# EAGLE board pc_healthypi_5.7 (EAGLE 9.6.2)
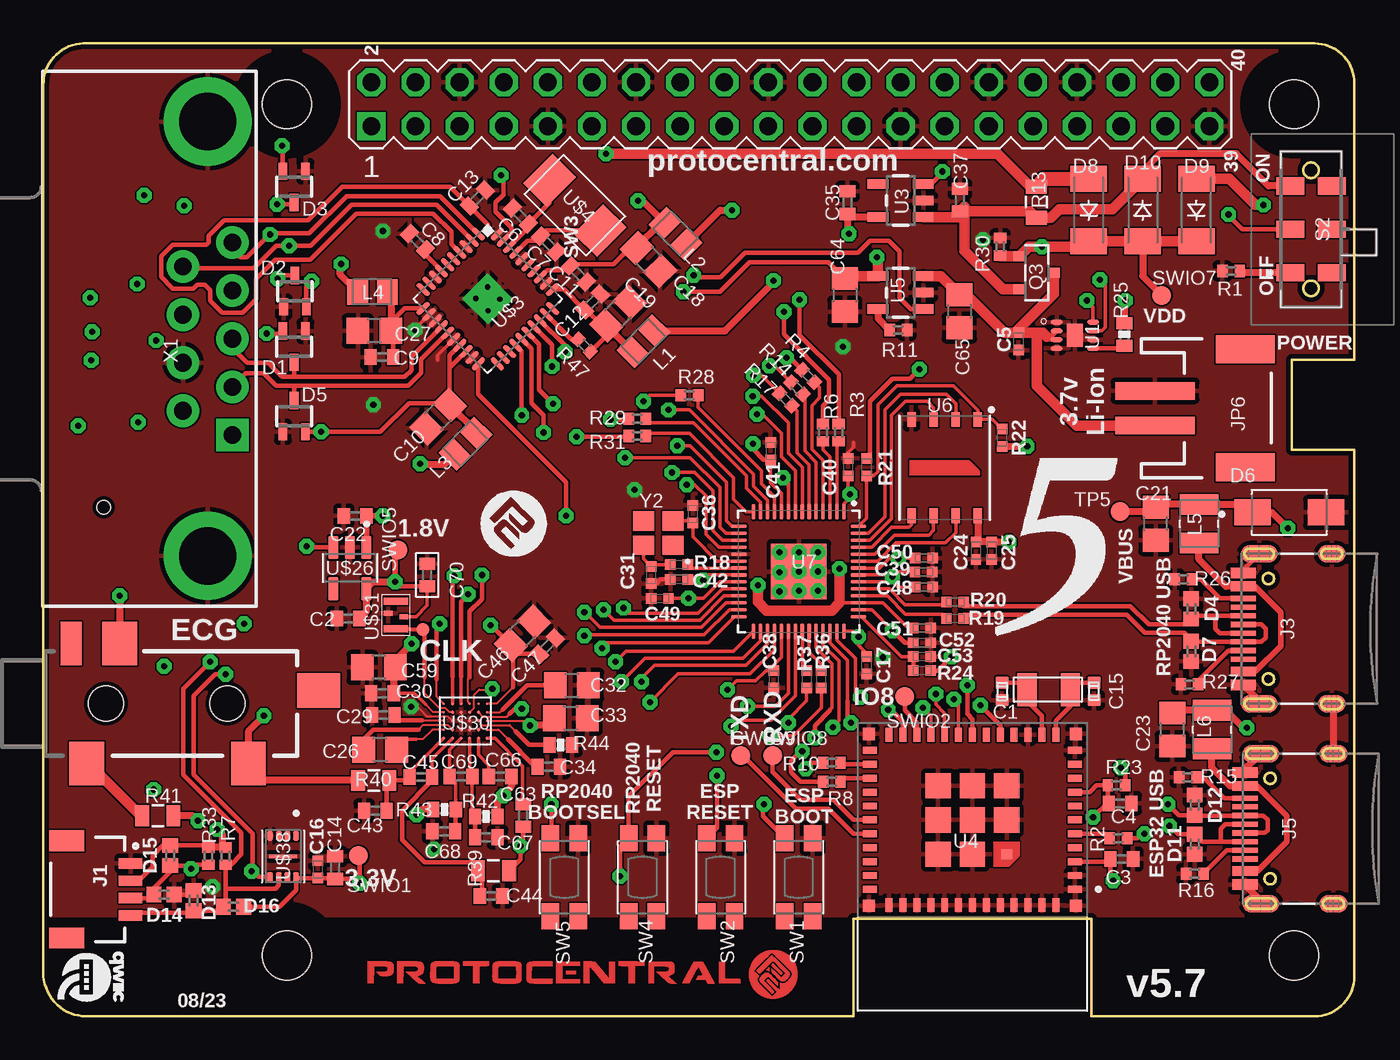
[diagram p3: board, top side]
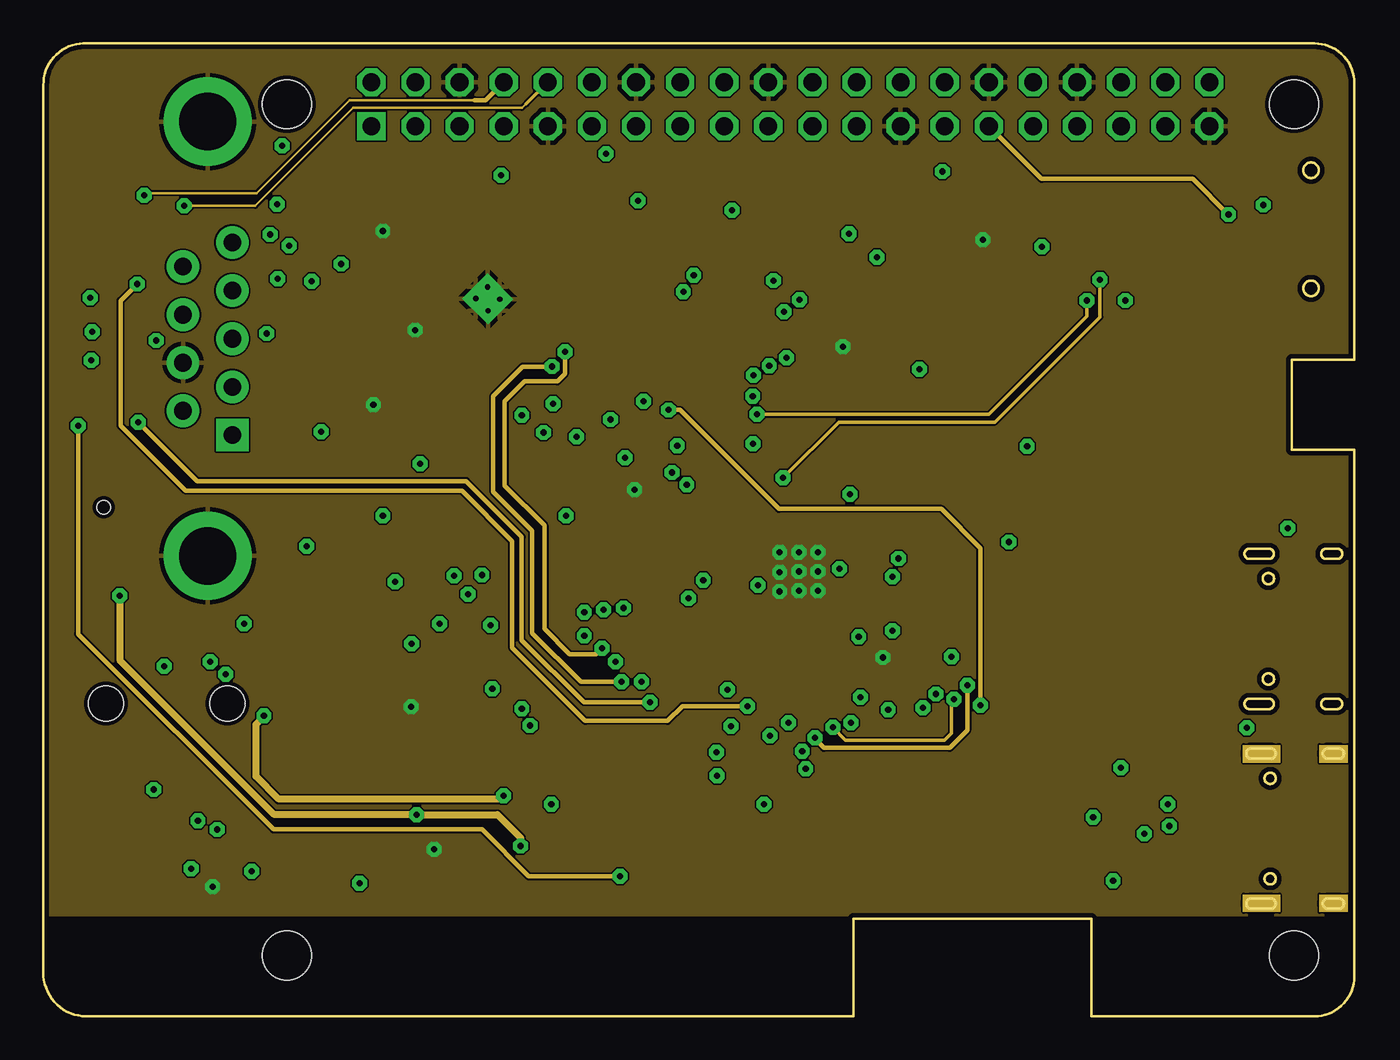
[diagram p4: board, inner layer Route2]
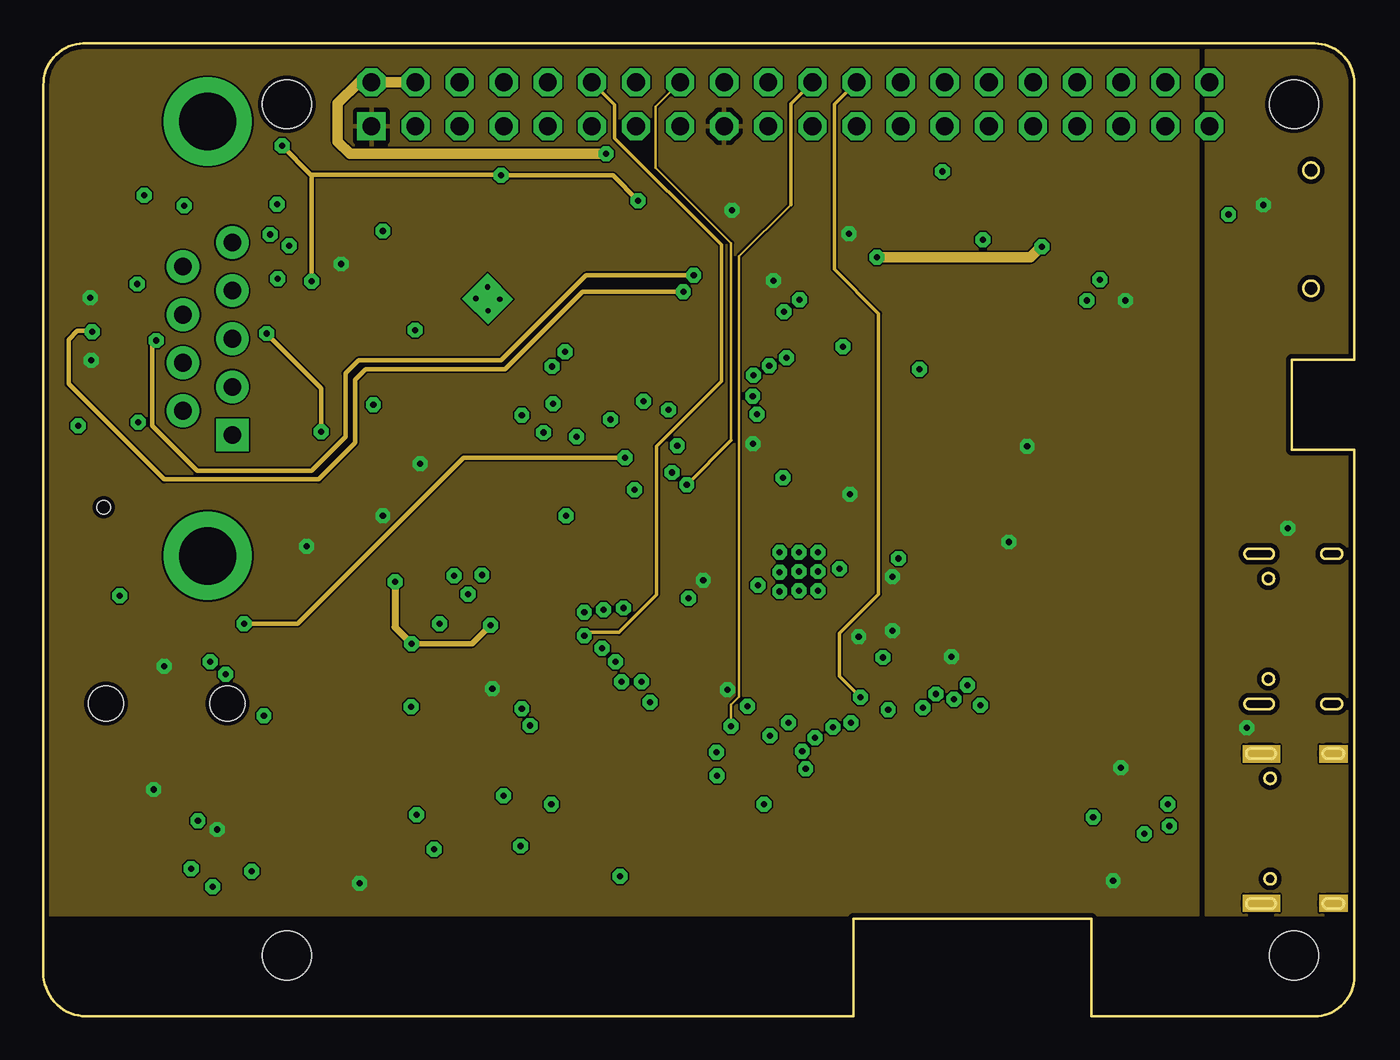
[diagram p5: board, inner layer Route15]
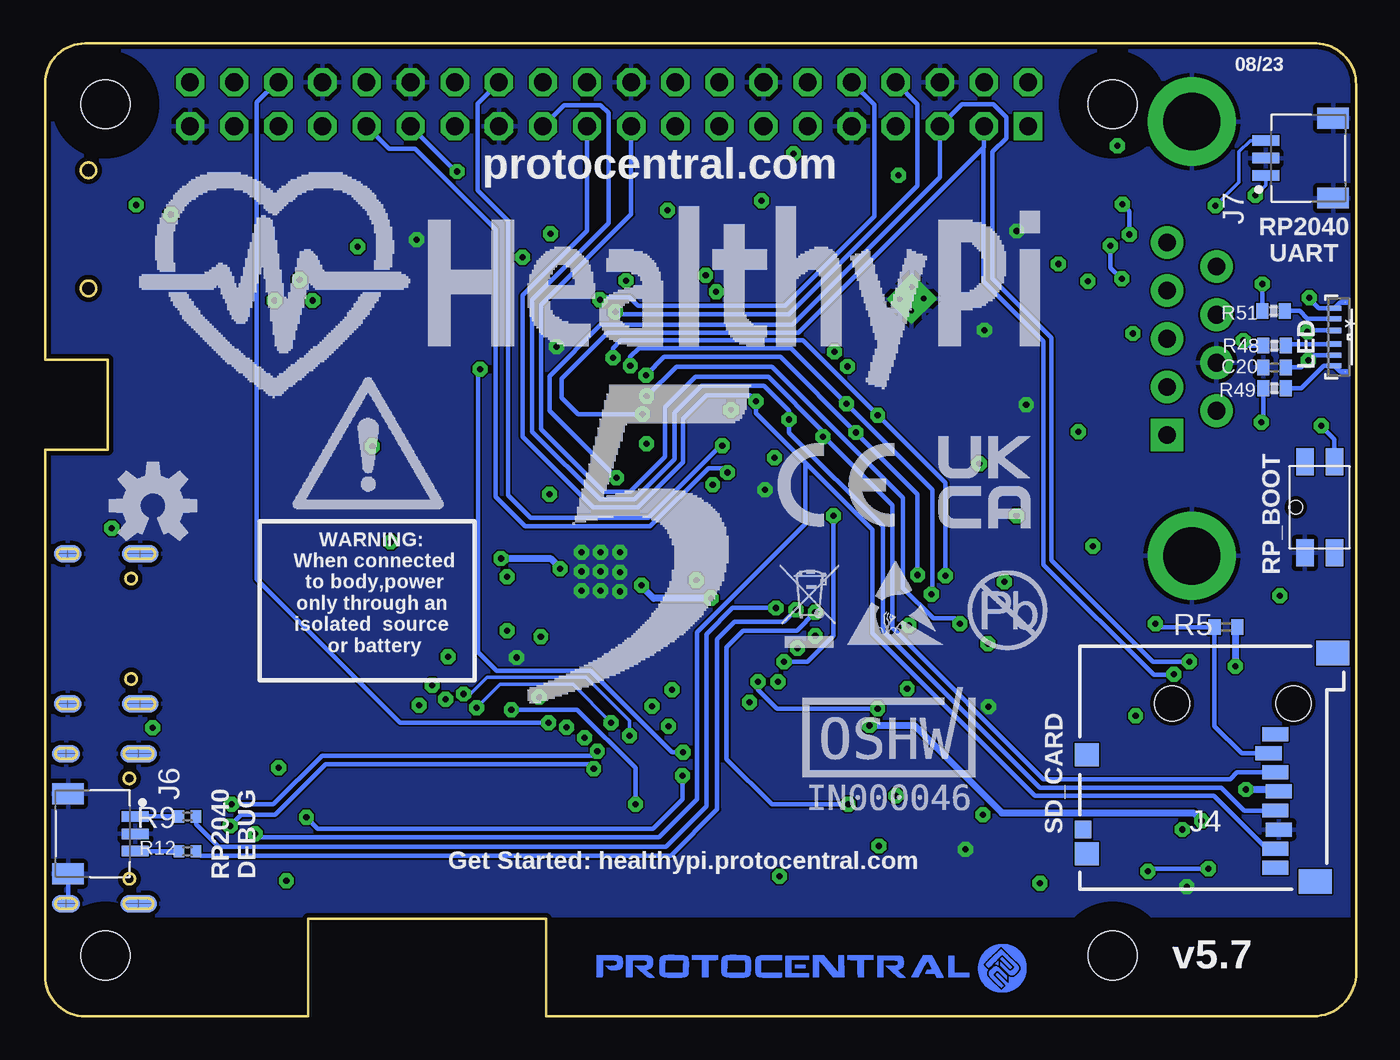
[diagram p6: board, bottom side, seen from below]

Size 75.5 x 56.01 mm. Coordinates in mm from the lower left corner, seen from the top.
Outline: 635 segments
Copper layers (1+2*15+16): Top 0.035mm / dielectric 1.5mm / Route2 0.035mm / dielectric 0.15mm / Route15 0.035mm / dielectric 0.2mm / Bottom 0.035mm
Design rules "Circuitects-Rules *": minimum track width 3mil, minimum drill 0.1mm, track to track 4mil, track to pad 4mil, pad to pad 4mil, via to via 6mil, smd to smd 6mil, copper to edge 10mil, drill to drill 4mil, minimum pad ring 12mil, minimum via ring 10mil, stop-mask expansion 4mil, vias tented up to drill 25mil, thermal gap 10mil
Net classes: 1 power: width 0.178 mm; 2 Clock: width 0.089 mm, clearance 0.178 mm; 4 USBpair: width 0.102 mm, drill 0.1 mm, clearance 0.15 mm to class 3; 5 IN pairs: width 0.152 mm, clearance 0.406 mm to class 0
Holes 2.8 mm at 72.02,3.51 72.02,52.51 14.02,52.51 14.02,3.51
Holes 0.9 mm at 73,48.71 73,41.91
Holes 0.65 mm at 70.64,7.92 70.64,13.7 70.55,19.42 70.55,25.2
tRestrict: area 12.5,51 to 15.6,54.1; area 70.5,51 to 73.6,54.1; area 70.5,2 to 73.6,5.1; area 12.5,2 to 15.6,5.1
bRestrict: area 12.5,2 to 15.6,5.1; area 12.5,51 to 15.6,54.1; area 70.5,2 to 73.6,5.1; area 70.5,51 to 73.6,54.1

## Footprints (pad centres in the part's own frame; a part is rotated, then mirrored left to right if it is on the bottom)
C0402 = smd 0.75 x 0.7: 1 0,0.5; 2 0,-0.5
C0402' = smd 0.7 x 0.9: 1 -0.65,0; 2 0.65,0
0402-TIGHT = smd 0.6 x 0.6: 1 -0.5,0; 2 0.5,0
C0805 = smd 1.3 x 1.5: 1 -0.95,0; 2 0.95,0
0402 = smd 0.7 x 0.9: 1 -0.65,0; 2 0.65,0
SOT323 = smd 0.5 x 1: 1 0,0.9; 2 -0.65,-0.9; 3 0.65,-0.9
0402' = smd 0.85 x 0.9: 1 -0.58,0; 2 0.58,0
DIOM4325X250N = smd 2.12 x 1.5: A 2.115,0; C -2.115,0
SOD-123_MINI-SMA = smd 1.5 x 2.1: A 1.8,0; C -1.8,0
JST04_1MM_RA = smd 0.6 x 1.35: 1 -1.5,0; 2 -0.5,0; 3 0.5,0; 4 1.5,0 | smd 1.2 x 2: NC1 2.8,-3.675; NC2 -2.8,-3.675
USB-C-16P = smd 0.3 x 1.45: A5 -1.25,0; A6 -0.25,0; A7 0.25,0; A8 1.25,0; B5 1.75,0; B6 0.75,0; B7 -0.75,0; B8 -1.75,0 | smd 0.6 x 1.45: GND -3.225,0; GND2 3.225,0 | smd 1 x 2.1: SHLD1 -4.32,-0.915; SHLD2 4.32,-0.915 | smd 1 x 2.1 bottom: SHLD3 -4.32,-0.915; SHLD4 4.32,-0.915 | smd 1 x 1.6: SHLD5 -4.32,-5.095; SHLD8 4.32,-5.095 | smd 1 x 1.6 bottom: SHLD6 -4.32,-5.095; SHLD7 4.32,-5.095 | smd 0.55 x 1.45: VBUS1 -2.45,0; VBUS2 2.45,0 | hole 0.65: -2.89,-1.445; 2.89,-1.445
GCT_MEM2051-00-195-00-A = smd 0.8 x 1.5: 1 1.94,-3.66; 2 0.84,-3.26; 3 -0.26,-3.66; 4 -1.36,-3.86; 5 -2.46,-3.66; 6 -3.56,-3.86; 7 -4.66,-3.66; 8 -5.76,-3.66 | smd 1 x 0.95: 9 -3.56,7.425 | smd 1.3 x 1.4: P1 -4.95,7.2; P2 0.75,7.2 | smd 1.4 x 1.9: P3 6.6,-6.95; P4 -6.55,-5.95
JST_SM03B-SRSS-TB(LF)(SN) = smd 0.6 x 1.55: 1 -1,0; 2 0,0; 3 1,0 | smd 1.2 x 1.8: S1 -2.3,-3.875; S2 2.3,-3.875
AUDIO-JACK-3.5MM-SMD = smd 2 x 2.5: RING 4.3,3.45; SLEEVE 2.4,-3.45; TIP 11.7,-3.45 | smd 1.2 x 2.5: RSH 1.5,3.45 | smd 2.5 x 2: TSH 15.75,0.75 | hole 2: 3.5,0; 10.5,0
JST-2-SMD = smd 1 x 4.6: 1 -1,-3.7; 2 1,-3.7 | smd 1.6 x 3.4: NC1 -3.4,1.5; NC2 3.4,1.5
PIN_20X2 = drill 1.016 square: 1 -24.13,-1.27 | drill 1.016 octagon: 2 -24.13,1.27; 3 -21.59,-1.27; 4 -21.59,1.27; 5 -19.05,-1.27; 6 -19.05,1.27; 7 -16.51,-1.27; 8 -16.51,1.27; 9 -13.97,-1.27; 10 -13.97,1.27; 11 -11.43,-1.27; 12 -11.43,1.27; 13 -8.89,-1.27; 14 -8.89,1.27; 15 -6.35,-1.27; 16 -6.35,1.27; 17 -3.81,-1.27; 18 -3.81,1.27; 19 -1.27,-1.27; 20 -1.27,1.27; 21 1.27,-1.27; 22 1.27,1.27; 23 3.81,-1.27; 24 3.81,1.27; 25 6.35,-1.27; 26 6.35,1.27; 27 8.89,-1.27; 28 8.89,1.27; 29 11.43,-1.27; 30 11.43,1.27; 31 13.97,-1.27; 32 13.97,1.27; 33 16.51,-1.27; 34 16.51,1.27; 35 19.05,-1.27; 36 19.05,1.27; 37 21.59,-1.27; 38 21.59,1.27; 39 24.13,-1.27; 40 24.13,1.27
INDC2012X105N = smd 1.2 x 1.47: 1 -0.86,0; 2 0.86,0
INDC2520X100N = smd 1.2 x 2.22: 1 -1.11,0; 2 1.11,0
LTST-008BGEW_LTO = smd 0.051 x 0.051: 1 2,0.372; 8 -2,0.372 | smd 0.305 x 0.813: 2 1.65,-0.268; 3 1.05,-0.268; 4 0.41,-0.268; 5 -0.38,-0.268; 6 -1.05,-0.268; 7 -1.65,-0.268
SOT23-R = smd 0.6 x 0.7: 1 -0.95,-1; 2 0.95,-1; 3 0,1
R0402 = smd 0.6 x 0.7: 1 -0.5,0; 2 0.5,0
R0402' = smd 0.7 x 0.9: 1 -0.65,0; 2 0.65,0
0805 = smd 0.8 x 1.2: 1 -0.9,0; 2 0.9,0
0402-RES = smd 0.7 x 0.9: 1 -0.65,0; 2 0.65,0
JS202011JAQN = smd 1 x 1.6: 1 -2.5,1.2; 2 0,1.2; 3 2.5,1.2; 4 -2.5,-1.2; 5 0,-1.2; 6 2.5,-1.2 | hole 0.9: -3.4,0; 3.4,0
BTN_KMR2_4.6X2.8 = smd 1.5 x 1: A 2.25,0.8; A' -2.25,0.8; B 2.25,-0.8; B' -2.25,-0.8
TP11R = smd 1.1 x 1.1: TP 0,0
PAD.03X.03 = smd 0.762 x 0.762: P$1 0,0
SON50P200X200X80-9N = smd 0.7 x 0.3: 1 -1.05,0.75; 2 -1.05,0.25; 3 -1.05,-0.25; 4 -1.05,-0.75; 5 1.05,-0.75; 6 1.05,-0.25; 7 1.05,0.25; 8 1.05,0.75 | smd 0.9 x 1.3: 9 0,0
SOT23-5 = smd 0.55 x 1.2: 1 -0.95,-1.3; 2 0,-1.3; 3 0.95,-1.3; 4 0.95,1.3; 5 -0.95,1.3
XCVR_ESP32-C3-MINI-1-N4 = smd 0.8 x 0.4: 1 -5.9,1.3; 2 -5.9,0.5; 3 -5.9,-0.3; 4 -5.9,-1.1; 5 -5.9,-1.9; 6 -5.9,-2.7; 7 -5.9,-3.5; 8 -5.9,-4.3; 9 -5.9,-5.1; 10 -5.9,-5.9; 11 -5.9,-6.7; 25 5.9,-6.7; 26 5.9,-5.9; 27 5.9,-5.1; 28 5.9,-4.3; 29 5.9,-3.5; 30 5.9,-2.7; 31 5.9,-1.9; 32 5.9,-1.1; 33 5.9,-0.3; 34 5.9,0.5; 35 5.9,1.3 | smd 0.4 x 0.8: 12 -4.8,-7.6; 13 -4,-7.6; 14 -3.2,-7.6; 15 -2.4,-7.6; 16 -1.6,-7.6; 17 -0.8,-7.6; 18 0,-7.6; 19 0.8,-7.6; 20 1.6,-7.6; 21 2.4,-7.6; 22 3.2,-7.6; 23 4,-7.6; 24 4.8,-7.6; 36 4.8,2.2; 37 4,2.2; 38 3.2,2.2; 39 2.4,2.2; 40 1.6,2.2; 41 0.8,2.2; 42 0,2.2; 43 -0.8,2.2; 44 -1.6,2.2; 45 -2.4,2.2; 46 -3.2,2.2; 47 -4,2.2; 48 -4.8,2.2 | smd 0.6 x 0.6: 49_1 -1.975,-0.725 | smd 1.45 x 1.45: 49_2 0,-0.725; 49_3 1.975,-0.725; 49_4 1.975,-2.7; 49_5 1.975,-4.675; 49_6 0,-4.675; 49_7 -1.975,-4.675; 49_8 -1.975,-2.7; 49_9 0,-2.7 | smd 0.7 x 0.7: 50 5.95,2.25; 51 5.95,-7.65; 52 -5.95,-7.65; 53 -5.95,2.25
WSON-8-6X5-SKINNY_CENTERPAD = smd 0.85 x 0.5: 1 -2.775,1.905; 2 -2.775,0.635; 3 -2.775,-0.635; 4 -2.775,-1.905; 5 2.775,-1.905; 6 2.775,-0.635; 7 2.775,0.635; 8 2.775,1.905
QFN-56 = smd 0.875 x 0.2: 1 -3.437,2.6; 2 -3.437,2.2; 3 -3.437,1.8; 4 -3.437,1.4; 5 -3.437,1; 6 -3.437,0.6; 7 -3.437,0.2; 8 -3.437,-0.2; 9 -3.437,-0.6; 10 -3.437,-1; 11 -3.437,-1.4; 12 -3.437,-1.8; 13 -3.437,-2.2; 14 -3.437,-2.6; 29 3.437,-2.6; 30 3.437,-2.2; 31 3.437,-1.8; 32 3.437,-1.4; 33 3.437,-1; 34 3.437,-0.6; 35 3.437,-0.2; 36 3.437,0.2; 37 3.437,0.6; 38 3.437,1; 39 3.437,1.4; 40 3.437,1.8; 41 3.437,2.2; 42 3.437,2.6 | smd 0.2 x 0.875: 15 -2.6,-3.437; 16 -2.2,-3.437; 17 -1.8,-3.437; 18 -1.4,-3.437; 19 -1,-3.437; 20 -0.6,-3.437; 21 -0.2,-3.437; 22 0.2,-3.437; 23 0.6,-3.437; 24 1,-3.437; 25 1.4,-3.437; 26 1.8,-3.437; 27 2.2,-3.437; 28 2.6,-3.437; 43 2.6,3.437; 44 2.2,3.437; 45 1.8,3.437; 46 1.4,3.437; 47 1,3.437; 48 0.6,3.437; 49 0.2,3.437; 50 -0.2,3.437; 51 -0.6,3.437; 52 -1,3.437; 53 -1.4,3.437; 54 -1.8,3.437; 55 -2.2,3.437; 56 -2.6,3.437 | smd 3.2 x 3.2: EPAD 0,0
QFN-40 = smd 0.95 x 0.28: 1 -3.025,2.25; 2 -3.025,1.75; 3 -3.025,1.25; 4 -3.025,0.75; 5 -3.025,0.25; 6 -3.025,-0.25; 7 -3.025,-0.75; 8 -3.025,-1.25; 9 -3.025,-1.75; 10 -3.025,-2.25; 21 3.025,-2.25; 22 3.025,-1.75; 23 3.025,-1.25; 24 3.025,-0.75; 25 3.025,-0.25; 26 3.025,0.25; 27 3.025,0.75; 28 3.025,1.25; 29 3.025,1.75; 30 3.025,2.25 | smd 0.28 x 0.95: 11 -2.25,-3.025; 12 -1.75,-3.025; 13 -1.25,-3.025; 14 -0.75,-3.025; 15 -0.25,-3.025; 16 0.25,-3.025; 17 0.75,-3.025; 18 1.25,-3.025; 19 1.75,-3.025; 20 2.25,-3.025; 31 2.25,3.025; 32 1.75,3.025; 33 1.25,3.025; 34 0.75,3.025; 35 0.25,3.025; 36 -0.25,3.025; 37 -0.75,3.025; 38 -1.25,3.025; 39 -1.75,3.025; 40 -2.25,3.025 | drill 0.3 pad 1.1 square: EXP@6 -0.5,0.475; EXP@7 0.5,0.475; EXP@10 -0.5,-0.475; EXP@11 0.5,-0.475
ABM3 = smd 1.9 x 2.4: 1 -2.05,0; 2 2.05,0
ECX-31B = smd 1.1 x 1.9: P$1 1.25,0; P$2 -1.25,0
EVQ-PUC = smd 1.55 x 1: 1 2.625,0.85; 2 2.625,-0.85; 3 -2.625,0.85; 4 -2.625,-0.85 | hole 0.75: 0,1.375
SOT95P285X140-5N = smd 1.35 x 0.6: 1 -1.185,0.95; 2 -1.185,0; 3 -1.185,-0.95; 4 1.185,-0.95; 5 1.185,0.95
30WLP = smd 0.15 x 0.15: A1 -1.25,1; A2 -0.75,1; A3 -0.25,1; A4 0.25,1; A5 0.75,1; A6 1.25,1; B1 -1.25,0.5; B6 1.25,0.5; C1 -1.25,0; C6 1.25,0; D1 -1.25,-0.5; D6 1.25,-0.5; E1 -1.25,-1; E2 -0.75,-1; E3 -0.25,-1; E4 0.25,-1; E5 0.75,-1; E6 1.25,-1 | smd 0.2 x 0.2: B2 -0.75,0.5; B3 -0.25,0.5; B4 0.25,0.5; B5 0.75,0.5; C2 -0.75,0; C3 -0.25,0; C4 0.25,0; C5 0.75,0; D2 -0.75,-0.5; D3 -0.25,-0.5; D4 0.25,-0.5; D5 0.75,-0.5
SIT1533 = smd 0.4 x 1.4: 1 -0.8,0; 3 0.8,0 | smd 0.3 x 0.5: 2 -0.1,-0.45; 4 0.1,0.45
PSON50P200X300X60-9N = smd 0.56 x 0.35: 1 -1.185,0.75; 2 -1.185,0.25; 3 -1.185,-0.25; 4 -1.185,-0.75; 5 1.185,-0.75; 6 1.185,-0.25; 7 1.185,0.25; 8 1.185,0.75 | smd 0.2 x 1.6: 9 0,0
DB9 = drill 1.016 pad 1.88 square: 1 -5.54,-1.42 | drill 1.016 pad 1.88: 2 -2.77,-1.42; 3 0,-1.42; 4 2.77,-1.42; 5 5.54,-1.42; 6 -4.15,1.42; 7 -1.38,1.42; 8 1.38,1.42; 9 4.15,1.42 | drill 3.302 pad 5.08: G1 -12.5,0; G2 12.5,0
CRYSTAL-SMD-2X2.5MM = smd 1.2 x 1.1: P1 0.846,0.69; P2 -0.854,0.69; P3 -0.854,-0.71; P4 0.846,-0.71

## Placement (x,y rotation side)
C1  12pF  [C0402]  55.2,18.71 0 top
C2  100nF  [C0402']  17.55,22.91 180 top
C3  1u  [C0402']  62.1,9.06 180 top
C4  1u  [C0402']  62,12.26 180 top
C5  0.1uF  [0402-TIGHT]  56.15,38.86 270 top
C6  22p  [C0402']  27.46,46.06 315 top
C7  22p  [C0402']  29.09,44.45 135 top
C8  2.2u  [C0402']  21.54,44.6 135 top
C9  0.1u  [C0402']  19.49,37.95 180 top
C10  1u  [C0805]  22.73,34.51 225 top
C11  0.1u  [C0402']  30.81,42.73 315 top
C12  0.1u  [C0402']  31.62,41.12 45 top
C13  2.2u  [C0402']  24.99,47.1 45 top
C14  100nF  [C0402']  16.8,8.56 90 top
C15  12pF  [C0402]  60.5,18.71 180 top
C16  0.1uF  [0402-TIGHT]  15.8,8.46 90 top
C17  0.1uF  [0402-TIGHT]  47.4,20.21 270 top
C18  10uF/0805  [C0805]  34.84,43.56 315 top
C19  10uF/0805  [C0805]  33.09,40.45 45 top
C20  100nF  [C0402']  4.7,37.36 180 bottom
C21  10uF  [C0805]  64.05,28.36 90 top
C22  100nF  [C0402']  17.95,28.81 180 top
C23  10uF  [C0805]  65,16.51 90 top
C24  0.1uF  [0402-TIGHT]  53.7,26.81 270 top
C25  2.2uF  [0402-TIGHT]  54.6,26.81 270 top
C26  1uF  [C0805]  19.39,15.35 180 top
C27  10uF/0805  [C0805]  19.06,39.46 180 top
C29  1nF  [C0402']  19.58,17.35 180 top
C30  1uF  [C0402']  19.53,18.6 180 top
C31  15pF  [0402-TIGHT]  35,25.41 90 top
C32  10uF  [C0805]  30.43,19.05 0 top
C33  10uF  [C0805]  30.36,17.17 0 top
C34  1uF  [C0402']  29.1,14.37 0 top
C35  1u  [C0402']  46.3,46.84 270 top
C36  15pF  [0402-TIGHT]  37.4,28.91 270 top
C37  1u  [C0402']  52.78,46.99 270 top
C38  0.1uF  [0402-TIGHT]  42.05,19.41 270 top
C39  0.1uF  [0402-TIGHT]  50.69,25.59 0 top
C40  0.1uF  [0402-TIGHT]  46.34,31.62 90 top
C41  0.1uF  [0402-TIGHT]  41.88,32.54 90 top
C42  0.1uF  [0402-TIGHT]  36.6,25.16 180 top
C43  10pF  [C0402']  19.12,11.84 180 top
C44  10pF  [C0402']  25.78,6.93 0 top
C45  DNP  [C0402']  21.73,13.78 180 top
C46  10uF  [C0805]  27.58,22.05 45 top
C47  1uF  [C0402']  29.03,21.32 45 top
C48  0.1uF  [0402-TIGHT]  50.7,24.71 0 top
C49  0.1uF  [0402-TIGHT]  35.5,24.06 180 top
C50  0.1uF  [0402-TIGHT]  50.71,26.38 0 top
C51  2.2uF  [0402-TIGHT]  50.6,22.36 0 top
C52  2.2uF  [0402-TIGHT]  50.6,21.51 0 top
C53  2.2uF  [0402-TIGHT]  50.6,20.71 0 top
C59  10uF  [C0805]  19.32,20.09 180 top
C63  47nF  [C0402']  27.63,11.57 90 top
C64  4.7u  [C0805]  46.15,41.52 270 top
C65  4.7u  [C0805]  52.75,40.59 270 top
C66  47nF  [C0402']  26.3,13.81 180 top
C67  DNP  [C0402']  25.5,10.31 0 top
C68  DNP  [C0402']  23.05,10.66 180 top
C69  DNP  [C0402']  24.05,13.81 180 top
C70  1uF  [0402]  22.1,25.41 90 top
D1  BAV99W-7-F  [SOT323]  14.44,38.55 180 top
D2  BAV99W-7-F  [SOT323]  14.49,41.75 0 top
D3  BAV99W-7-F  [SOT323]  14.44,47.75 180 top
D4  PESD0402-0402  [0402']  66.1,23.46 270 top
D5  BAV99W-7-F  [SOT323]  14.44,34.55 0 top
D6  SMAJ6.0A  [DIOM4325X250N]  71.75,29.01 0 top
D7  PESD0402-0402  [0402']  66.1,21.01 90 top
D8  DNP  [SOD-123_MINI-SMA]  60.2,46.41 90 top
D9  S1B-13-F  [SOD-123_MINI-SMA]  66.4,46.41 90 top
D10  S1B-13-F  [SOD-123_MINI-SMA]  63.3,46.41 270 top
D11  PESD0402-0402  [0402']  66.3,9.91 90 top
D12  PESD0402-0402  [0402']  66.3,12.16 270 top
D13  PESD0402-0402  [0402']  8.65,6.66 270 top
D14  PESD0402-0402  [0402']  6.95,7.01 180 top
D15  PESD0402-0402  [0402']  7.3,9.26 90 top
D16  PESD0402-0402  [0402']  10.95,6.31 0 top
J1  10147606-00004LF  [JST04_1MM_RA]  5.02,7.31 270 top
J3  USB4105-GF-A  [USB-C-16P]  69.1,22.31 90 top
J4  MEM2051-00-195-00-A  [GCT_MEM2051-00-195-00-A]  8.3,14.31 90 bottom
J5  USB4105-GF-A  [USB-C-16P]  69.2,10.81 90 top
J6  SM03B-SRSS-TB(LF)(SN)  [JST_SM03B-SRSS-TB(LF)(SN)]  70.3,10.51 270 bottom
J7  SM03B-SRSS-TB(LF)(SN)  [JST_SM03B-SRSS-TB(LF)(SN)]  5.2,49.41 90 bottom
JP3  35RASMT4BHNTRX  [AUDIO-JACK-3.5MM-SMD]  0.1,18.01 0 top
JP6  S2B-PH-SM4-TB(LF) (SN)  [JST-2-SMD]  67.72,35.01 270 top
K1  PIN20X2 (2223)  [PIN_20X2]  43.02,52.51 0 top
L1  BLM18PG471SN1D  [INDC2012X105N]  34.55,38.86 225 top
L2  BLM18PG471SN1D  [INDC2012X105N]  36.4,45.06 135 top
L3  BLM18PG471SN1D  [INDC2012X105N]  24.3,32.96 45 top
L4  BLM18PG471SN1D  [INDC2012X105N]  18.95,41.71 0 top
L5  MAKK2520H100M  [INDC2520X100N]  66.55,28.36 90 top
L6  MAKK2520H100M  [INDC2520X100N]  67.3,16.51 90 top
LED1  LTST-006GEBW-P2  [LTST-008BGEW_LTO]  1,39.11 270 bottom
Q3  SI2323DS-TI-GE3  [SOT23-R]  57.2,42.81 270 top
R1  DNP  [R0402]  68.4,42.91 0 top
R2  0R  [R0402]  61.9,10.26 180 top
R3  100R  [R0402]  45.8,33.61 90 top
R4  100R  [R0402]  44.05,36.86 135 top
R5  10K  [R0402']  7.5,22.41 0 bottom
R6  100R  [R0402]  44.9,33.61 90 top
R7  10K  [R0402]  10.5,9.22 270 top
R8  22R  [R0402]  45.4,13.51 0 top
R9  100R  [R0402]  67.3,11.51 0 bottom
R10  22R  [R0402]  45.4,14.61 0 top
R11  1k  [R0402]  49.23,39.51 180 top
R12  100R  [R0402]  67.3,9.51 0 bottom
R13  0R  [0805]  57.18,46.87 270 top
R14  100R  [R0402]  43.4,36.16 135 top
R15  5.1K  [R0402]  65.9,13.76 180 top
R16  5.1K  [R0402]  66.3,8.21 180 top
R17  100R  [R0402]  42.75,35.51 135 top
R18  1k  [0402-TIGHT]  36.6,26.01 0 top
R19  27  [0402-TIGHT]  52.5,22.91 180 top
R20  27  [0402-TIGHT]  52.5,23.86 180 top
R21  1k  [0402-TIGHT]  47.4,31.61 90 top
R22  10k  [0402-TIGHT]  55.2,33.31 270 top
R23  10K  [R0402]  61.8,13.31 0 top
R24  200OHM-0402T-1/16W-1%  [0402-TIGHT]  50.6,19.91 0 top
R25  10K  [0402-RES]  62.25,39.26 90 top
R26  5.1K  [R0402]  65.65,25.16 180 top
R27  5.1K  [R0402]  66,19.11 180 top
R28  100R  [R0402]  37.2,35.76 180 top
R29  100R  [R0402]  34.2,34.41 180 top
R30  10K  [R0402]  55.1,44.31 270 top
R31  100R  [R0402]  34.2,33.41 180 top
R33  10K  [R0402]  9.5,9.22 270 top
R36  0R  [0402-TIGHT]  44.8,19.41 270 top
R37  0R  [0402-TIGHT]  43.95,19.41 270 top
R39  200K  [0805]  25.92,8.39 180 top
R40  200K  [0805]  19.02,13.58 0 top
R41  0R  [0805]  6.59,11.54 180 top
R42  0R  [0402-RES]  25.5,11.51 180 top
R43  0R  [0402-RES]  23.1,11.91 0 top
R44  DNP  [0402-RES]  29.79,15.63 0 top
R47  10K  [R0402]  31.14,38.61 135 top
R48  330R  [0402-RES]  4.7,38.61 0 bottom
R49  330R  [0402-RES]  4.7,36.16 0 bottom
R51  330R  [0402-RES]  4.75,40.61 180 bottom
S2  JS202011JAQN  [JS202011JAQN]  73,45.31 90 top
SW1  KMR211GLFS  [BTN_KMR2_4.6X2.8]  43.5,8.01 270 top
SW2  KMR211GLFS  [BTN_KMR2_4.6X2.8]  39,8.01 270 top
SW4  KMR211GLFS  [BTN_KMR2_4.6X2.8]  34.5,8.01 270 top
SW5  KMR211GLFS  [BTN_KMR2_4.6X2.8]  30,8.01 270 top
SWIO1  TPSQTP11R  [TP11R]  18.15,9.26 0 top
SWIO2  TPSQTP11R  [TP11R]  49.6,18.41 270 top
SWIO5  TPSQTP11R  [TP11R]  20.4,26.86 180 top
SWIO7  TPSQTP11R  [TP11R]  64.4,41.51 0 top
SWIO8  TPSQTP11R  [TP11R]  41.99,15.01 0 top
SWIO9  TPSQTP11R  [TP11R]  40.15,15.01 0 top
TP2  TEST-POINT3  [PAD.03X.03]  21.85,22.26 0 top
TP5  TPSQTP11R  [TP11R]  62,29.06 0 top
U1  MAX17048G+TDFN-08  [SON50P200X200X80-9N]  59.4,39.21 0 top
U3  TCR2EF33,LM(CT  [SOT23-5]  49.37,46.96 90 top
U4  ESP32-C3-MINI-1-N4  [XCVR_ESP32-C3-MINI-1-N4]  53.5,8.61 180 top
U5  MCP73831T-2ATI/OT  [SOT23-5]  49.37,41.66 90 top
U6  W25Q128JVPIQ  [WSON-8-6X5-SKINNY_CENTERPAD]  51.9,31.59 270 top
U7  RP2040TR13  [QFN-56]  43.5,25.61 270 top
U$2  [HEALTHYPI_5_ONLY]  54.85,21.94 0 top
U$3  AFE4400RHAR  [QFN-40]  25.59,41.3 315 top
U$4  ABM3  [ABM3]  30.6,46.69 135 top
U$5  OSHW-LOGOM  [OSHW-LOGO-M]  69.29,29.39 0 bottom
U$7  [OSHW_LOGO]  32.9,10.56 0 bottom
U$14  [CESYMBOLE-5MM]  34.19,27.01 0 bottom
U$17  [WARNINGSYM]  61.33,29.13 0 bottom
U$19  520-327-12.5-34B(32.768KHZ)  [ECX-31B]  57.9,18.81 180 top
U$20  [HEALTHYPIV5LOGO]  70.01,18.1 0 bottom
U$22  [PC_LOGO_ONELINE_ROUND]  18.55,0.91 0 top
U$24  EVQ-PUC  [EVQ-PUC]  2.1,29.31 90 bottom
U$26  TCR2EF18,LM(CT  [SOT95P285X140-5N]  17.65,25.81 270 top
U$27  [PC_LOGO_ONELINE_ROUND]  43.85,1.26 0 bottom
U$30  MAX30001CWV+  [30WLP]  24.3,17.01 180 top
U$31  SIT1533AI-H4-DCC-32.768E  [SIT1533]  20.3,23.11 270 top
U$35  [PCROUNDLOGO]  21.55,24.31 0 top
U$38  ATECC608A-MAHDA-T  [PSON50P200X300X60-9N]  13.8,9.21 270 top
U$47  [ESDSYMBOLE]  29.41,20.93 0 bottom
U$51  [UKCE]  24.04,28.11 0 bottom
U$52  [WEE_SYMBOLE]  33.16,21.22 0 bottom
U$53  [PB_FREE_SYMBOLE]  22.45,21 0 bottom
U$59  [QWIIC#LABEL#FULL#M#PNG]  2.73,2.34 270 top
X1  A-DF09A/KG-T2S  [DB9]  9.46,39.01 90 top
Y2  NX3225SA-12MHZ-STD-CSR-3  [CRYSTAL-SMD-2X2.5MM]  35.4,27.81 180 top

## Tracks (layer width: path | path; a pad name or v marks a point on that pad's centre or on a via)
1.1V  (via drill 0.35)
  Top 0.2: U7.23 38.95,25.01 38,24.06 v37.15,24.06 C49.1 | C51.1 49.8,22.36 48.35,23.81 U7.45 45.9,23.81 | U7.50 48.15,25.81 48.72,26.38 49.23,26.38 v49.25,26.36 50.19,26.36 C50.1 | v41.15,24.82 40.96,25.01 | 45.9,25.81 v45.85,25.76 | 45.9,23.81 45.85,23.86 | 45.9,23.81 45.85,23.81 45.83,23.78
  Top 0.61: 45.83,23.78 45.4,23.36 41.65,23.36 41.15,23.86 v41.15,24.82 | v45.85,25.76 45.85,23.86
  Bottom 0.2: 41.15,24.76 v41.15,24.82 | 45.85,25.81 v45.85,25.76
  Bottom 0.406: v37.15,24.06 40.45,24.06 41.15,24.76 | v49.25,26.36 46.4,26.36 45.85,25.81
!ADC_RESET
  Top 0.254: U$3.29 30.4,38.97 R47.2
!RESET!  (via drill 0.35)
  Top 0.2: U7.26 39.3,23.81 37.9,22.41 32.05,22.41 31.2,23.26 v31.15,23.26
  Top 0.254: v29.25,12.21 29.25,10.31 SW5.B'
  Bottom 0.254: v31.15,23.26 32.2,22.21 35.3,22.21 36.25,21.26 36.25,14.81 33.65,12.21 v29.25,12.21
+1.8V  (via drill 0.35)
  Top 0.127: U$30.D6 22.45,17.51 22,17.96 | U$30.E1 26.1,18.01 27.05,18.96
  Top 0.2: 22,17.96 21.36,18.6 C30.1
  Top 0.203: C70.1 22.1,23.66 21.45,23.01 U$31.4
  Top 0.254: C70.1 20.5,24.76 v20.25,25.01 | C46.1 27.05,21.24 27.05,18.96 | C47.1 27.43,20.86 C46.1 | v25.75,22.51 25.78,22.51 C46.1
  Top 0.305: SWIO5.TP 20.25,26.71 v20.25,25.01
  Top 0.406: C2.1 18.6,23.31 U$26.5 18.98,25.01 v20.25,25.01 | C30.1 20.18,20 C59.1 20.27,20.53 v21.2,21.46
  Route15 0.305: v21.2,21.46 24.7,21.46 v25.75,22.51
  Route15 0.406: v20.25,25.01 20.25,22.41 v21.2,21.46
+3V3  (via drill 0.35)
  Top 0.127: U$30.D3 24.8,17.76 24.8,18.51 25.1,18.81 25.8,18.81 v25.85,18.86
  Top 0.2: U7.44 47.7,23.41 v48.9,22.21 | U7.33 42.5,20.67 42.05,20.22 C38.1 41.6,19.91 41,19.31 39.9,19.31 v39.4,18.81 | U7.49 48.8,25.41 v48.9,25.31 | C39.1 49.33,25.59 49.05,25.31 v48.9,25.31 | U7.48 48.8,25.01 48.85,25.06 | v48.9,25.31 48.75,25.16 48.85,25.06 | C48.1 49.2,24.71 48.85,25.06 | U7.10 42.5,30.11 41.88,30.73 C41.1 | C17.1 47.4,20.91 46.95,21.36 v46.95,21.86 46.64,22.17 U7.42 | U7.22 38.3,25.41 v38,25.11 | U7.1 46.1,29.51 46.45,29.86 v46.45,30.06 46.34,30.17 C40.1
  Top 0.254: U4.3 61.3,8.91 C3.2 61.45,7.96 v61.6,7.81 | C52.1 49.6,21.51 v48.9,22.21 | R23.2 62.3,14.06 v62.05,14.31 | v52.3,20.71 51.5,19.91 R24.2 | v38,25.11 37.95,25.16 C42.1 | SWIO1.TP 18.2,9.21 v18.2,7.66 17.95,7.91 C14.1 16.75,7.96 C16.1 14.62,7.96 U$38.8 14.55,7.26 13.6,6.31 D16.2 | C41.1 41.48,32.04 40.86,32.66 v40.86,32.96 | U$26.3 15.21,26.99 v15.15,27.06 | J1.2 5.5,7.81 6.3,8.61 6.3,9.26 6.88,9.84 D15.2 9.39,9.84 R33.1
  Top 0.305: U$26.1 C22.1 v19.55,28.81
  Top 0.406: U6.8 53.8,27.41 | 53.8,27.41 C24.1 | 53.8,27.41 53.91,27.31 C25.1 v55.6,27.31 | U3.5 46.48,46.01 C35.2 46.3,45.16 v46.4,45.06 | v62.3,41.21 62.25,41.16 R25.2 | R22.2 v56.65,32.81 | R33.1 R7.1 10.3,9.92 10.3,10.46 v10,10.76 | L2.1 38.97,46.41 v39.65,46.41 | L1.1 39.26,39.47 42.05,42.26 v42.05,42.36 | L4.1 17.1,42.7 17.1,43.26 v17.15,43.31 | L3.1 23.1,31.76 21.75,31.76 v21.7,31.81
  Bottom 0.254: LED1.8 0.92,41.11 LED1.7 2.15,40.76 2.7,41.31 v2.7,41.36 | LED1.3 2.45,38.06 v2.75,37.76 3.15,37.36 C20.1
  Bottom 0.406: J4.4 4.55,13.06 v6.35,13.06 | R5.2 6.95,22.31 v6.95,20.16
  pour Route15: 0,5.81 66.5,5.81 66.5,56.01 0,56.01
+5V  (via drill 0.35)
  Top 0.61: R13.1 56.84,47.77 54.95,49.66 v32.4,49.66
  Top 0.813: R13.1 57.62,48.21 D8.A
  Route15 0.61: v32.4,49.66 17.65,49.66 16.95,50.36 16.95,52.56 18.17,53.78 K1.2 K1.4
ALRT
  Top 0.254: U1.5 62.1,38.46 R25.1
AVDD
  Top 0.2: U7.43 47.1,23.01 49.4,20.71 C53.1
  Top 0.254: C53.1 R24.1
BOOT  (via drill 0.35)
  Top 0.254: v38.75,15.21 36.25,15.21 33.7,12.66 SW4.B' 33.2,9.76 v33.2,8.06 | v50.45,37.26 49.9,36.71 48.9,36.71 47.6,35.41 47.6,32.31 R21.2
  Route2 0.254: v2,34.01 2,22.01 13.25,10.76 25.25,10.76 27.95,8.06 v33.2,8.06
  Bottom 0.254: v38.75,15.21 39.4,15.21 44.1,19.91 49.5,19.91 50.55,20.96 50.55,37.16 v50.45,37.26 | U$24.2 1.25,33.23 2,33.98 v2,34.01
CHR_STUS  (via drill 0.35)
  Top 0.254: U5.1 49.95,40.71 49.3,41.36 49.3,44.06 48.7,44.66 47.6,44.66 46.9,43.96 40.4,43.96 39,42.56 37.55,42.56 v37.45,42.66
  Route15 0.254: v37.45,42.66 31.25,42.66 26.35,37.76 18.15,37.76 17.4,37.01 17.4,33.36 15.45,31.41 8.85,31.41 6.26,34 6.26,38.62 6.5,38.86 v6.5,38.91
  Bottom 0.254: v6.5,38.91 6.2,38.61 R48.1
D+  (via drill 0.35)
  Top 0.254: J5.A6 70.35,10.56 70.5,10.71 70.5,11.31 70.25,11.56 J5.B6 66.32,11.56 D12.2 65.4,11.58 64.82,12.16 64.8,12.16 v64.75,12.21 | R8.1 43.6,13.51 43.05,14.06 43.05,14.71 43.6,15.26 v43.7,15.26
  Bottom 0.254: v43.7,15.26 43.95,15.01 59.55,15.01 62.35,12.21 v64.75,12.21
D-  (via drill 0.35)
  Top 0.254: J5.B7 67.8,10.06 | 67.8,10.06 66.73,10.06 D11.2 65.35,10.49 64.88,10.96 v64.85,10.96 | J5.A7 68.05,11.06 67.8,10.81 67.8,10.06 | R10.1 44.25,14.61 v43.9,14.26 v43.9,14.25
  Bottom 0.254: v43.9,14.25 44.16,14.51 59.35,14.51 62.25,11.61 64.2,11.61 v64.85,10.96
ECG_CS  (via drill 0.35)
  Top 0.127: 22.65,19.41 22.65,18.41 U$30.E6
  Top 0.2: U7.7 43.7,31.61 42.9,32.41 42.9,34.16 41.35,35.71 v40.85,35.71
  Top 0.254: 22.65,19.41 22.65,22.45 v22.81,22.61
  Bottom 0.254: v40.85,35.71 39.15,37.41 33.65,37.41 26.1,29.86 26.1,24.66 24.35,22.91 23.11,22.91 v22.81,22.61
ECG_VCM  (via drill 0.35)
  Top 0.127: 29.25,17.01 C33.1 | U$30.C1 27.7,17.01 27.96,16.74 v28.01,16.74
  Top 0.406: v8.9,11.26 8.62,11.54 R41.1 | C33.1 28.99,16.74 v28.01,16.74
  Bottom 0.406: v28.01,16.74 25.44,16.74 20.4,11.71 9.35,11.71 v8.9,11.26
ECGN
  Top 0.2: U$30.A6 21.08,14.04 C45.2
  Top 0.254: C45.2 20.88,13.58 R40.2 19.77,13.43 C43.1
ECGN1  (via drill 0.35)
  Top 0.406: R40.1 12.78,13.58 JP3.TIP 11.8,16.41 v12.7,17.31 | C66.1 26.95,13.26 26.45,12.76 v26.5,12.71 26.15,12.36 R42.1
  Route2 0.406: v26.5,12.71 26.3,12.51 13.55,12.51 12.25,13.81 12.25,16.81 12.7,17.26 v12.7,17.31
ECGP
  Top 0.2: U$30.A5 22.38,14.84 C45.1
  Top 0.254: R39.2 25.02,8.86 | C44.1 25.27,7.07 25.27,8.86 25.02,8.86 | C45.1 22.38,13.58 20.65,11.85 20.65,10.16 21.95,8.86 25.02,8.86
ECGP1  (via drill 0.35)
  Top 0.254: R39.1 27.48,9.05 v27.48,9.81 27.63,9.96 C63.1
  Top 0.406: R43.1 21.8,11.91 v21.5,11.61 | v4.4,24.21 JP3.RING
  Route2 0.406: v27.48,9.81 27.48,10.28 26.15,11.61 v21.5,11.61 13.3,11.61 4.4,20.51 v4.4,24.21
EN  (via drill 0.35)
  Top 0.254: S2.2 69.05,45.31 68.25,46.11 v68.25,46.16 | U3.3 51.1,47.91 51.8,48.61 v51.77,48.63
  Route2 0.254: v68.25,46.16 66.2,48.21 57.48,48.21 K1.29
  Bottom 0.254: v51.77,48.63 51.84,48.63 K1.29
ESP32_CS  (via drill 0.35)
  Top 0.2: U7.12 41.7,29.71 40.9,30.51 40.9,31.21 37.2,34.91 v36,34.91
  Top 0.254: U4.16 55.1,16.76 v53.95,17.91
  Route2 0.254: v53.95,17.91 53.95,26.96 51.7,29.21 42.35,29.21 36.65,34.91 v36,34.91
ESP32_MISO
  Top 0.254: U4.5 61.15,10.51 R2.2
ESP32_SD_TFT_MISO  (via drill 0.35)
  Top 0.2: R28.2 34.9,35.76 v34.55,35.41
  Top 0.254: R2.1 63,10.26 63.25,10.51 v63.4,10.51
  Bottom 0.254: 31.7,31.86 34.55,34.71 v34.55,35.41 34.9,35.76 37.4,35.76 38.75,34.41 38.75,31.91 41.35,29.31 43.95,29.31 48,33.36 48,41.51 44.29,45.22 K1.21 | 31.7,31.86 27.85,28.01 27.85,22.06 18.5,12.71 8.2,12.71 5.14,9.65 J4.7 | v63.4,10.51 63.2,10.31 40.15,10.31 37.95,12.51 37.95,22.11 31.7,28.36 31.7,31.86
ESP32_SD_TFT_MOSI  (via drill 0.35)
  Top 0.254: R31.2 33.65,33.36 v30.7,33.36
  Bottom 0.254: J4.3 6.86,14.05 7.25,13.66 18,13.66 26.7,22.36 26.7,29.41 30.65,33.36 v30.7,33.36 30.7,33.66 33.85,36.81 38.05,36.81 39.8,35.06 39.8,32.21 41.81,30.2 42.89,30.2 42.9,30.21 43.35,30.21 46.95,33.81 46.95,40.96 41.75,46.16 K1.19
ESP32_SD_TFT_SCK  (via drill 0.35)
  Top 0.254: R29.2 33.65,34.36 v32.65,34.36
  Bottom 0.254: J4.5 6.44,11.85 7.75,13.16 18.2,13.16 27.25,22.21 27.25,28.21 32.65,33.61 v32.65,34.36 32.65,34.86 34.1,36.31 37.7,36.31 39.25,34.76 39.25,32.06 41.55,29.76 43.55,29.76 47.45,33.66 47.45,41.26 43.05,45.66 43.05,52.01 43.5,52.46 45.61,52.46 K1.23
ESP32_UART_CTS  (via drill 0.35)
  Top 0.2: U7.39 44.9,21.36 45.8,20.46 45.8,17.01 45.45,16.66 v45.48,16.63 | v52.44,18.25 52.7,17.99 U4.19
  Route2 0.2: v45.48,16.63 46.2,15.91 51.9,15.91 52.3,16.31 52.3,18.11 v52.44,18.25
ESP32_UART_RTS  (via drill 0.35)
  Top 0.2: U7.38 44.5,21.21 45.4,20.31 45.4,17.76 45.3,17.66
  Top 0.254: U4.18 53.5,17.11 53.2,17.41 v53.2,19.06 | v44.42,16.03 44.42,16.73 45.3,17.61 45.3,17.66
  Route2 0.254: v53.2,19.06 53.2,16.46 52.2,15.46 44.95,15.46 44.4,16.01 v44.42,16.03
ESP32_UART_RXD  (via drill 0.35)
  Top 0.2: R37.2 43.95,18.16 42.9,17.11 v42.9,16.91 | v50.65,17.76 51.1,17.31 U4.21
  Bottom 0.2: v42.9,16.91 45.1,19.11 49.3,19.11 v50.65,17.76
ESP32_UART_TXD  (via drill 0.35)
  Top 0.2: R36.2 44.8,17.76 43.2,16.16 v41.85,16.16 | U4.20 51.9,17.46 51.4,17.96 v51.4,18.56
  Bottom 0.2: v41.85,16.16 41.85,17.01 44.35,19.51 50.05,19.51 51,18.56 v51.4,18.56
ESP_BOOT  (via drill 0.35)
  Top 0.254: SW1.B' 41.45,11.51 41.45,12.16 v41.5,12.21 | v48.65,17.66 48.8,17.66 49.5,16.96 U4.23
  Bottom 0.254: v41.5,12.21 41.5,14.31 44.85,17.66 v48.65,17.66
ESP_RST  (via drill 0.35)
  Top 0.254: U4.8 60.25,12.91 60.65,13.31 R23.1 61.3,12.31 | C4.2 61.3,12.31 | v38.8,13.86 38.8,10.86 SW2.B' | v60.45,11.46 61.3,12.31
  Bottom 0.254: v38.8,13.86 38.8,12.51 40.5,10.81 59.8,10.81 v60.45,11.46
FCLK
  Top 0.127: U$30.D5 23.39,17.51 23.15,17.75 22.81,17.75 21.95,18.61 21.95,19.51
  Top 0.254: 21.95,19.51 21.95,22.16 TP2.P$1 U$31.3
GND  (via drill 0.35)
  Top 0.127: U$30.C5 23.3,17.26 22.1,17.26 21.65,17.71 21.29,17.71 v21.17,17.83
  Top 0.2: U$3.12 21.4,39.59 v21.4,39.51 | U$3.16 22.7,38.06 22.7,37.76 | C40.2 46.34,32.45 46.65,32.76 46.65,33.06
  Top 0.254: C42.2 35.55,25.16 35.3,24.91 C31.1 | J3.GND2 69.1,25.71 J3.SHLD2 | D13.1 8.42,7.01 D14.1
  Top 0.406: J3.SHLD3 70.02,18.17 J3.GND | J3.SHLD6 74.3,17.89 J5.SHLD7 | J5.GND2 69.2,14.21 J5.SHLD2 | J5.GND 70.11,6.67 J5.SHLD1
  Bottom 0.254: J6.S2 74.17,6.61 J5.SHLD6
  other vias: 22.5,9.61 54.1,44.71 19.55,45.21 48.35,20.66 34.05,30.31 43.5,25.61 19,35.21 46.05,38.56 42.4,26.71 42.4,25.56 43.5,26.71 44.6,26.71 42.4,24.46 43.5,24.51 44.6,24.51 44.6,25.61 9.75,7.46
  pour Bottom: 0,5.81 75.22,5.81 arc90 75.52,6.11 75.52,54.01 arc90 73.52,56.01 2.17,56.01 arc90 0,53.33
  pour Top: 0,5.81 75.22,5.81 arc90 75.52,6.11 75.52,53.71 arc90 73.22,56.01 2.43,56.01 arc90 0,53.51
  pour Route2: 0,5.81 75.6,5.81 75.6,56.01 0,56.01
IN_N  (via drill 0.35)
  Top 0.254: U$3.1 22.86,47.21 17.45,47.21 15.31,45.07 13.11,45.07 v13.05,45.01 13,45.01 11.7,43.71 11.32,43.71 10.88,44.15 X1.5 | v13.45,46.76 14.35,46.76 D3.1
  Bottom 0.254: v13.05,45.01 13.05,46.36 v13.45,46.76
IN_P  (via drill 0.35)
  Top 0.254: U$3.2 22.66,46.71 17.75,46.71 15.39,44.35 v14.16,44.35 v14.15,44.36 13.4,44.36 12.09,43.05 8.14,43.05 X1.9 | v13.5,42.46 13.69,42.65 D2.1
  Bottom 0.254: v14.15,44.36 14.15,43.11 v13.5,42.46
INTB  (via drill 0.35)
  Top 0.127: U$30.D2 25.3,17.26 26.7,17.26 26.85,17.41
  Top 0.2: U7.31 41.7,21.46 40.45,20.21 35.2,20.21 34.45,19.46 v34.45,19.26
  Top 0.254: 26.85,17.41 27.15,17.71 v27.55,17.71
  Bottom 0.254: v27.55,17.71 33.35,17.71 34.45,18.81 v34.45,19.26
LED1  (via drill 0.35)
  Top 0.2: U7.34 42.9,18.61 42.15,17.86 v40.55,17.86
  Route2 0.254: v40.55,17.86 36.8,17.86 35.95,17.01 31.2,17.01 27,21.21 27,27.36 24.1,30.26 8.2,30.26 4.45,34.01 4.45,41.21 v5.4,42.16
  Bottom 0.254: v5.4,42.16 R51.2
LED2  (via drill 0.35)
  Top 0.2: U7.32 42.1,21.11 40.7,19.71 36.55,19.71 v34.92,18.08
  Route2 0.254: v34.92,18.08 31.12,18.08 27.55,21.66 27.55,27.61 24.35,30.81 8.85,30.81 v5.45,34.21
  Bottom 0.254: v5.45,34.21 5.35,34.31 R49.1
LED_DRV_SUP  (via drill 0.35)
  Top 0.254: U$3.17 23.4,38.05 23.4,37.34 | 23.4,37.34 C10.1 23.28,35.31 21.05,35.31 19.39,33.65 v16,33.65 D5.3 | U$3.18 23.4,37.34 | D1.3 13.65,39.31 v12.85,39.31
  Top 0.406: C10.1 24.91,33.68 L3.2
  Route15 0.254: v12.85,39.31 16,36.16 v16,33.65
MISO  (via drill 0.35)
  Top 0.127: U$30.E3 24.45,18.11 24.45,19.41 24.55,19.51
  Top 0.2: R17.2 41.35,36.91 v40.9,36.91
  Top 0.254: 24.55,19.51 24.55,23.31 25.25,24.01 v25.25,25.41 | U$3.25 28.1,38.44 28.1,35.31 28.8,34.61 v28.8,33.61
  Bottom 0.254: v40.9,36.91 39.85,37.96 33.15,37.96 v28.8,33.61 25.25,30.06 v25.25,25.41
MOSI  (via drill 0.35)
  Top 0.2: 24.05,19.56 U$30.E4 | R14.2 42.1,37.46 v41.8,37.46
  Top 0.254: v24.45,24.31 24.45,24.26 24.05,23.86 24.05,19.56 | U$3.26 28.55,38.69 28.55,36.06 v29.35,35.26
  Bottom 0.254: v41.8,37.46 41.8,37.96 41.3,38.46 32.55,38.46 v29.35,35.26 24.4,30.31 24.4,24.36 v24.45,24.31
N$1
  Top 0.406: S2.1 69,42.81 R1.2
N$2
  Bottom 0.254: LED1.4 3.96,38.7 R48.2
N$3
  Top 0.2: U7.4 44.9,32.01 44.25,32.66 44.25,35.15 44.7,35.6 44.7,36.2 R4.1
N$4
  Top 0.2: R3.1 45.7,33.01 U7.2
N$5
  Top 0.2: R6.1 44.9,32.61 45.3,32.21 U7.3
N$6  (via drill 0.35)
  Top 0.2: U7.24 39.1,24.61 37.7,23.21 33.7,23.21 v33.4,23.51
  Bottom 0.254: R9.2 66.8,11.06 65.5,9.76 39.75,9.76 37.4,12.11 37.4,22.01 35.9,23.51 v33.4,23.51
N$7
  Top 0.254: J5.B5 68,12.56 66.8,13.76 R15.1
N$8
  Top 0.406: S2.3 70.55,47.81 68.7,49.66 64.3,49.66 63.3,48.66 D10.C
  Top 0.61: U3.1 53.05,46.01 | D10.C 61.55,46.46 58.5,46.46 58.01,45.97 R13.2 56.81,46.34 C37.2 53.05,46.61 53.05,46.01 | Q3.2 55.25,41.86 53.05,44.06 53.05,46.01
N$9
  Top 0.254: U$3.38 27.92,45.4 C6.2 29.15,46.83 U$4.2
N$10
  Top 0.254: J5.A5 68.15,9.56 R16.1
N$11
  Top 0.2: U7.5 44.5,31.91 43.85,32.56 43.85,35.71 R14.1
N$12
  Top 0.254: U4.30 46.65,11.31 45.5,12.46 43.6,12.46 41.99,14.07 SWIO8.TP
N$13
  Top 0.254: U$3.37 27.89,44.66 28.38,44.66 C7.2 28.96,45.24 U$4.1
N$14
  Top 0.2: U7.21 37.3,25.81 R18.2
N$15
  Top 0.254: U$3.7 22,43.83 C8.1
N$16
  Top 0.2: U7.6 44.1,31.76 43.4,32.46 43.4,34.86 R17.1
N$17
  Top 0.254: U4.31 46.65,10.51 45.2,11.96 43.35,11.96 40.3,15.01 SWIO9.TP
N$18
  Top 0.406: U5.5 48.07,40.17 R11.2
N$19
  Top 0.2: U7.20 38.8,26.21 37.4,27.61 C36.2 37.29,28.52 Y2.P3
N$20
  Top 0.2: R18.1 35.1,26.01 C31.2 34.55,26.35 Y2.P1
N$21
  Top 0.254: J3.B5 67.75,24.06 66.65,25.16 R26.1
N$23
  Top 0.2: U7.11 42.1,29.91 41.35,30.66 41.35,31.41 37.7,35.06 R28.1
N$25
  Top 0.254: U4.12 58.3,17.01 59.15,17.86 U$19.P$2 59.55,19.21 C15.2
N$26
  Top 0.254: J3.A5 68.25,21.06 66.5,19.31 R27.1
N$27
  Top 0.254: U4.13 57.5,17.31 56.65,18.16 U$19.P$1 56.25,19.21 C1.1
N$28
  Top 0.2: U7.36 43.7,20.16 R37.1
N$29
  Top 0.2: U7.37 44.1,20.96 44.8,20.26 R36.1
N$30
  Top 0.2: U7.13 41.3,29.61 40.5,30.41 40.5,31.11 37.45,34.16 34.95,34.16 R29.1
N$31
  Top 0.254: U4.22 50.3,16.91 49.6,17.61 SWIO2.TP
N$32  (via drill 0.35)
  Top 0.2: U7.25 39.2,24.21 37.8,22.81 32.85,22.81 v32.25,23.41
  Bottom 0.254: R12.2 66.55,9.26 39.45,9.26 36.8,11.91 36.8,21.71 35.8,22.71 32.95,22.71 v32.25,23.41
N$33
  Top 0.2: U7.14 40.46,29.04 39.75,29.76 39.75,31.01 37.2,33.56 34.85,33.56 R31.1
N$34
  Top 0.305: J3.VBUS1 69.8,19.86 71.25,21.31 71.25,23.26 69.75,24.76 J3.VBUS2
  Top 0.406: J3.VBUS2 68.1,24.76 66.55,26.31 L5.1
N$35
  Top 0.305: J5.VBUS1 69.9,8.36 71.6,10.06 71.6,11.56 69.9,13.26 J5.VBUS2
  Top 0.406: J5.VBUS2 68.35,13.26 67.3,14.31 L6.1
N$36
  Bottom 0.254: R49.2 3.15,36.16 1.85,37.46 LED1.2 0.92,37.11 LED1.1
N$46
  Bottom 0.254: LED1.6 2.8,40.16 3.25,40.61 R51.1
N$53
  Top 0.127: U$30.C6 21.85,17.01 21.8,17.06
  Top 0.254: 21.8,17.06 20.52,17.06 C29.1
N$55
  Top 0.127: U$30.B5 23.3,16.76 21.85,16.76 21.6,16.51
  Top 0.254: C26.2 18.44,15.95 19,16.51 21.6,16.51
N$56
  Top 0.127: U$30.D1 26.3,17.51 26.45,17.66
  Top 0.254: 26.45,17.66 27.84,19.05 C32.1
N$57
  Top 0.127: 28.24,14.37 C34.1 | U$30.B1 26.2,16.51 26.75,15.96
  Top 0.254: 26.75,15.96 28.24,14.47 28.24,14.37
N$59
  Top 0.61: JP3.SLEEVE 2.57,14.56 5.59,11.54 R41.2
N$60
  Top 0.127: U$30.B6 22.4,16.51 21.85,15.96 21.45,15.96
  Top 0.2: 21.45,15.96 20.95,15.96 C26.1
N$61
  Top 0.2: U$30.A1 26,16.01 27.6,14.41 27.6,12.25 C63.2
N$62
  Top 0.2: U$30.A2 25.05,15.06 25.65,14.46 C66.2
N$63
  Top 0.2: U$30.A3 24.55,13.96 C69.1 24.7,11.66 R42.2
  Top 0.254: R42.2 C67.1
N$64
  Top 0.2: U$30.A4 23.4,15.36 C69.2 23.75,13.46 R43.2
  Top 0.254: R43.2 23.75,10.71 C68.1
N$65
  Top 0.127: 25.05,16.53 25.28,16.76 26.85,16.76 27.2,16.41
  Top 0.15: U$30.B2 25.05,16.53
  Top 0.254: 27.2,16.41 27.98,15.63 R44.1
QSPI-0
  Top 0.2: U7.53 47.7,27.01 48.85,28.16 49.85,28.16 49.99,28.3 U6.5
QSPI-1
  Top 0.2: U7.55 47.5,27.81 48.45,28.76 48.45,34.91 49.35,35.81 52,35.81 52.53,35.27 U6.2
QSPI-2
  Top 0.2: U7.54 47.6,27.41 48.85,28.66 48.85,34.61 49.65,35.41 50.9,35.41 51.27,35.04 U6.3
QSPI-3
  Top 0.2: U7.51 48.05,26.21 49.1,27.26 51.95,27.26 52.53,27.84 U6.7
QSPI-CLK
  Top 0.2: U7.52 47.9,26.61 49,27.71 51,27.71 51.27,27.97 U6.6
QSPI-CS
  Top 0.2: U7.56 47.4,28.67 R21.1 47.8,31.11 48.05,31.36 48.05,35.21 49.15,36.31 52.4,36.31 53.8,34.9 U6.1 54.65,34.36 R22.1
RX_ANA_SUP  (via drill 0.35)
  Top 0.254: U$3.33 29.01,42.96 30.11,42.96 C11.1 30.46,43.31 32.84,43.31 33.77,44.24 34.1,44.24 C18.1 | D2.3 15.14,42 v15.45,42.31 | v13.75,50.11 13.79,50.07 D3.3 | U$3.39 26.95,45.14 26.95,45.41 26.05,46.31 26.05,46.86 26.5,47.31 26.5,48.26 v26.35,48.41 | 34.36,46.85 v34.25,46.96
  Top 0.406: 34.1,44.24 35.53,45.67 L2.2 34.61,46.85 34.36,46.85
  Route15 0.254: v15.45,42.31 15.45,48.46 | v13.75,50.11 15.4,48.46 15.45,48.46 | 15.45,48.46 26.3,48.46 v26.35,48.41 32.8,48.41 v34.25,46.96
RX_DIG_SUP
  Top 0.254: U$3.31 29.97,41.85 C12.1 31.29,40.66 32.17,39.78 C19.1 32.74,39.45 32.69,39.45 32.59,39.36 R47.1
  Top 0.406: L1.2 32.83,39.36 32.59,39.36
SCK  (via drill 0.35)
  Top 0.2: 23.55,19.56 U$30.E5
  Top 0.254: v23.65,25.36 23.55,25.26 23.55,19.56 | U$3.24 27.55,38.28 v27.55,34.61 | R4.2 | R4.2 43,37.91 v42.8,37.91
  Bottom 0.254: v42.8,37.91 42.8,38.46 42.35,38.91 31.85,38.91 v27.55,34.61 23.65,30.71 v23.65,25.36
SD_CS  (via drill 0.35)
  Top 0.2: U7.16 39.3,27.81 38.95,28.16 38.95,30.46 37.25,32.16 v33.5,32.16
  Route15 0.254: v33.5,32.16 24.2,32.16 14.65,22.61 v11.55,22.61
  Bottom 0.254: J4.2 6.59,15.15 8.15,16.71 R5.1 11.35,22.41 v11.55,22.61
SPO2_CS  (via drill 0.35)
  Top 0.2: U7.30 41.3,21.61 40.3,20.61 34.65,20.61 v33.3,19.26
  Top 0.254: U$3.27 29.3,38.65 v29.3,37.41
  Route2 0.254: v29.3,37.41 27.6,37.41 25.9,35.71 25.9,30.21 28.15,27.96 28.15,22.06 30.95,19.26 v33.3,19.26
SPO2_DRDY  (via drill 0.35)
  Top 0.2: U7.28 39.8,23.01 38.3,21.51 32.4,21.51 32.16,21.27 v32.16,21.19
  Top 0.254: U$3.28 30.04,38.62 v30.04,38.25
  Route2 0.254: v30.04,38.25 30.04,37 29.6,36.56 27.7,36.56 26.55,35.41 26.55,30.56 28.85,28.26 28.85,22.31 30.3,20.86 31.83,20.86 v32.16,21.19
SPO2_START  (via drill 0.35)
  Top 0.2: U7.29 39.74,21.01 33.55,21.01 v32.95,20.41
  Top 0.254: U$3.20 25.04,35.82 30.1,30.76 v30.1,28.81
  Bottom 0.254: v30.1,28.81 30.1,21.91 31.6,20.41 v32.95,20.41
SW1  (via drill 0.35)
  Top 0.2: U7.15 39.66,28.21 39.35,28.52 39.35,30.76 37.25,32.86 v36.5,32.86
  Bottom 0.254: v36.5,32.86 36.6,32.86 40.75,28.71 47.55,28.71 48.85,30.01 48.85,45.81 50.6,47.56 50.6,52.54 K1.26
SW2  (via drill 0.35)
  Top 0.2: U7.17 39.1,27.41 38.55,27.96 38.55,30.26 37.5,31.31 v36.2,31.31
  Bottom 0.254: v36.2,31.31 36.45,31.56 37.3,31.56 40.65,28.21 47.85,28.21 49.55,29.91 49.55,45.3 54.19,49.94 55.69,49.94 K1.31
SW3  (via drill 0.35)
  Top 0.2: U7.18 38.9,27.01 38.15,27.76 38.15,29.96 37.5,30.61 v37.05,30.61
  Route15 0.152: 39.6,33.16 39.6,44.51 35.25,48.86 35.25,52.36 K1.16
  Route15 0.2: v37.05,30.61 39.6,33.16
SWDCK
  Bottom 0.254: J6.1 R9.1
SWDIO
  Bottom 0.254: J6.3 R12.1
TFT_BKL  (via drill 0.35)
  Top 0.2: U7.27 39.5,23.41 38.05,21.96 31.2,21.96 v31.15,21.91
  Route15 0.2: K1.12 32.9,52.46 32.9,50.56 39.05,44.41 39.05,36.56 35.3,32.81 35.3,24.26 33.15,22.11 31.35,22.11 v31.15,21.91
TFT_CS  (via drill 0.35)
  Top 0.2: U7.41 45.7,21.66 46.75,20.61 46.75,18.66 v47.05,18.36 v47.05,18.37
  Route15 0.2: v47.05,18.37 45.85,19.57 45.85,22.06 48.1,24.31 48.1,40.46 45.55,43.01 45.55,52.5 K1.24
TFT_DC  (via drill 0.35)
  Top 0.2: U7.35 43.3,18.46 41.9,17.06 39.95,17.06 v39.6,16.71
  Route15 0.152: v39.6,16.71 39.6,17.93 40.06,18.39 40.06,43.74 43.05,46.73
  Route15 0.2: K1.22 43.05,52.54 43.05,46.73
TFT_RESET  (via drill 0.35)
  Top 0.2: U7.40 45.3,21.51 46.3,20.51 46.3,18.16
  Top 0.254: v46.5,16.91 46.3,17.11 46.3,18.16
  Bottom 0.254: v46.5,16.91 55.05,16.91 63.3,25.16 63.3,52.61 62.13,53.78 K1.36
TMP_SCL  (via drill 0.35)
  Top 0.2: U7.9 42.9,30.71 v42.6,31.01 | v60.85,42.41 61.15,42.11 61.15,39.66 60.95,39.46 U1.7
  Top 0.254: v9.6,20.41 8.05,18.86 8.05,13.91 11.4,10.56 11.4,9.32 10.8,8.72 R7.2 10.5,7.36 | J1.4 5.17,5.96 8.53,5.96 D13.2 10.14,6.08 D16.1 10.5,6.44 10.5,7.36 | U$38.6 13.55,7.53 13.37,7.36 10.5,7.36
  Route2 0.2: v42.6,31.01 45.8,34.21 54.8,34.21 60.85,40.26 v60.85,42.41
  Bottom 0.254: v42.6,31.01 46.45,34.86 46.45,36.86 43.5,39.81 32.45,39.81 23.97,48.29 K1.5 22.7,52.51 20.9,52.51 20.15,51.76 20.15,50.56 20.95,49.76 20.95,42.46 17.55,39.06 17.55,26.26 11.7,20.41 v9.6,20.41
TMP_SDA  (via drill 0.35)
  Top 0.2: U7.8 43.3,31.41 42.5,32.21 42.5,33.56 41.4,34.66 v41.1,34.66 | v60.1,41.21 60.45,40.86 U1.8
  Top 0.254: 9.5,8.62 R33.2 8.72,8.72 v8.5,8.51 8.33,8.68 D15.1 7.3,8.33 6.37,7.4 D14.2 6.17,6.81 J1.3 | 12.98,7.96 U$38.5 12.38,8.02 12.05,8.36 | 12.05,8.36 v12,8.36 | v10.5,19.7 9.89,19.7 8.65,18.46 8.65,13.91 12.05,10.51 12.05,8.36
  Route2 0.2: v41.1,34.66 54.45,34.66 60.1,40.31 v60.1,41.21
  Bottom 0.254: v41.1,34.66 44.8,34.66 45.75,35.61 45.75,36.71 43.1,39.36 32.1,39.36 21.45,50.01 | K1.3 21.43,50.03 21.45,50.01 | v10.5,19.7 10.54,19.66 11.65,19.66 18,26.01 18,38.86 21.45,42.31 21.45,50.01 | v12,8.36 11.85,8.51 v8.5,8.51
TX_CTRL_SUP
  Top 0.254: 20.31,38.13 C9.1 20.14,39.45 20.15,39.46 C27.1 20.01,39.76 20.01,39.98 20.79,40.75 U$3.11
  Top 0.406: L4.2 20.01,41.51 20.01,39.76
TX_N
  Top 0.254: U$3.14 21.19,37.97 21.19,37.21 20.79,36.81 14.4,36.81 | X1.3 10.88,38.46 11.72,37.61 12.94,37.61 13.75,36.81 14.4,36.81 | D1.1 14.44,36.85 14.4,36.81
TX_P
  Top 0.254: U$3.15 21.75,37.81 21.75,37.06 20.99,36.3 14.55,36.3 | X1.2 11.65,37.01 12.7,37.01 13.4,36.3 14.55,36.3 | D5.1 14.44,36.19 14.55,36.3
U0RXD  (via drill 0.35)
  Top 0.254: R6.2 44.9,35.16 45.25,35.51 45.25,36.66 42.65,39.26 v42.65,40.56
  Route2 0.152: 24.82,52.74 17.64,52.74 12.28,47.37 5.99,47.37 5.95,47.41
  Route2 0.2: v5.8,47.26 5.95,47.41
  Route2 0.254: 24.82,52.74 25.47,52.74 K1.8
  Bottom 0.2: v5.8,47.26 5.2,47.86 J7.1
  Bottom 0.254: v42.65,40.56 42.5,40.41 32.65,40.41 25.25,47.81 25.25,52.52 K1.8
U0TXD  (via drill 0.35)
  Top 0.254: R3.2 45.8,36.96 43.55,39.21 v43.55,41.26
  Route2 0.152: 27.8,52.53 27.56,52.29 17.83,52.29 12.2,46.66 v8.1,46.66
  Route2 0.2: K1.10 27.8,52.53 | 8.55,46.66 v8.1,46.66
  Bottom 0.2: v8.1,46.66 6.75,48.01 6.75,49.76 6.1,50.41 J7.3
  Bottom 0.254: v43.55,41.26 43.4,41.41 41.85,41.41 41.35,40.91 32.9,40.91 27.75,46.06 27.75,52.48 K1.10
USB_D+
  Top 0.254: U4.27 46.1,13.71 R8.2
USB_D-
  Top 0.254: U4.26 46,14.51 R10.2
USB_F_N
  Top 0.2: U7.46 48.6,24.21 49.65,23.16 51.75,23.16 R19.2
USB_F_P
  Top 0.2: U7.47 48.73,24.61 49.63,23.71 51.85,23.71 R20.2
USB_F_RP_D+
  Top 0.254: J3.B6 67.5,23.06 | 67.5,23.06 66.28,23.06 D4.2 65.78,22.56 63.65,22.56 62.6,23.61 53,23.61 R20.1 | J3.A6 67.75,22.06 67.5,22.31 67.5,23.06
USB_F_RP_D-
  Top 0.254: J3.A7 70.15,22.56 70.4,22.31 70.4,21.81 70.15,21.56 J3.B7 66.13,21.56 D7.2 66.1,21.69 65.7,22.09 63.42,22.09 62.4,23.11 53,23.11 R19.1
VBAT
  Top 0.254: 57.8,39.11 57.9,39.11 | U1.2 58.1,39.21 57.8,39.21 57.9,39.11 | U1.3 58.05,38.96 57.9,39.11
  Top 0.61: U5.3 51.68,42.61 C65.1 53.17,41.54 55.35,39.36 C5.1 | Q3.3 58.2,41.61 56.15,39.56 C5.1 | C5.1 57.1,39.36 | 57.1,39.36 57.55,39.36 57.8,39.11 | JP6.2 59.5,34.01 57.2,36.31 57.2,39.26 57.1,39.36
VBUS  (via drill 0.35)
  Top 0.406: C23.2 65.16,17.62 L6.2 68.09,17.62 69.1,16.61 v69.3,16.61 | TP5.TP 63.8,29.06 C21.2 64.21,29.47 L5.2 69.44,29.47 69.9,29.01 | D6.C 69.9,29.01 | 69.9,29.01 70.75,29.01 v71.65,28.11
  Top 0.61: D9.A 68.3,48.21 69.8,46.71 v70.25,46.71
  pour Route15: 66.95,55.61 75.45,55.61 75.5,55.66 75.5,5.91 75.4,5.81 66.95,5.81
VCM
  Top 0.254: U$3.4 23.5,44.45 23.5,45.16 22.45,46.21 18,46.21 15.35,43.56 13.35,43.56 12.25,42.46 12.25,41.29 11.46,40.51 10.29,40.51 9.61,41.19 9.61,41.8 9.3,42.11 8.84,42.11 8.62,41.89 7.46,41.89 6.77,42.57 6.77,43.74 7.46,44.43 9.37,44.43 9.51,44.57 9.51,44.93 10.39,45.82 15.26,45.82 17.2,47.76 23.41,47.76 C13.1 25.6,45.57 25.6,45.36
VDD  (via drill 0.35)
  Top 0.254: C64.1 45.22,43.41 40.65,43.41 38.95,41.71 v36.85,41.71
  Top 0.406: D10.A 63.3,42.61 SWIO7.TP
  Top 0.61: D9.C D10.A D8.C 59.9,44.31 v57.5,44.31 56.75,44.31 Q3.1 55.15,43.76 R30.2 | C64.1 46.28,42.61 U5.4 48.07,43.64 v48,43.71
  Route15 0.254: v36.85,41.71 31.05,41.71 26.6,37.26 18.55,37.26 17.95,36.66 17.95,33.01 15.85,30.91 6.95,30.91 1.45,36.41 1.45,38.96 1.95,39.46 2.8,39.46 v2.8,39.41
  Route15 0.61: v48,43.71 56.85,43.71 57.5,44.36 v57.5,44.31
  Bottom 0.254: v2.8,39.41 2.72,39.49 LED1.5

## Text on the board
tPlace: 2 | 40 | protocentral.com | ON | 39 | SW3 | OFF | VDD | POWER | 3.7v / Li-Ion | 1.8V | VBUS | ECG | RP2040 USB | CLK | IO8 | TXD | RXD | RP2040 / RESET | RP2040 / BOOTSEL | ESP / RESET | ESP / BOOT | ESP32 USB | 3.3V | v5.7 | 08/23
bPlace: 08/23 | protocentral.com | RP2040 / UART | LED | RP_BOOT | WARNING: / When connected / to body,power / only through an / isolated source / or battery | SD_CARD | RP2040 / DEBUG | Get Started: healthypi.protocentral.com | v5.7